# Altium schematic sheet Sheet1.SchDoc
size A4
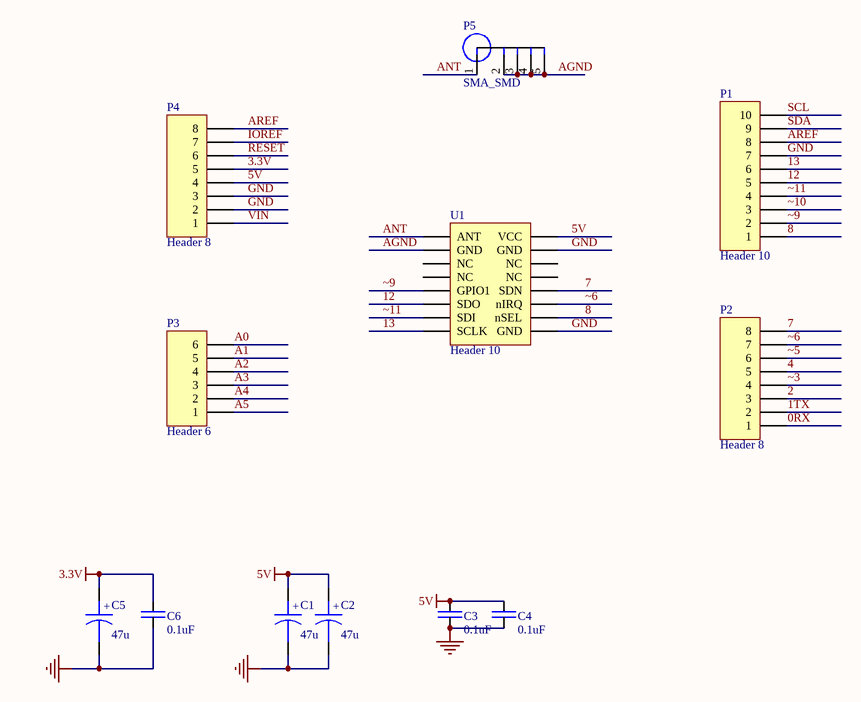
[diagram p0: Sheet1.SchDoc]

## Parts
C1  47u  [3216C]
C2  47u  [3216C]
C3  0.1uF  [0603]
C4  0.1uF  [0603]
C5  47u  [3216C]
C6  0.1uF  [0603]
P1  Header 10  [HDR1X10]
P2  Header 8  [HDR1X8]
P3  Header 6  [HDR1X6]
P4  Header 8  [HDR1X8]
P5  SMA_SMD  [SMA]
U1  Header 10  [RF4463F30]

## Nets
3.3V: C5.1 C6.1 P4.5
5V: C1.1 C2.1 C3.1 C4.1 P4.4 U1.1(VCC)
GND: C1.2 C2.2 C3.2 C4.2 C5.2 C6.2 P1.7 P4.2 P4.3 U1.2(GND) U1.8(GND)
0RX: P2.1
1TX: P2.2
2: P2.3
4: P2.5
7: P2.8 U1.5(SDN)
8: P1.1 U1.7(nSEL)
12: P1.5 U1.11(SDO)
13: P1.6 U1.9(SCLK)
A0: P3.6
A1: P3.5
A2: P3.4
A3: P3.3
A4: P3.2
A5: P3.1
AGND: P5.2 P5.3 P5.4 P5.5 U1.15(GND)
ANT: P5.1 U1.16(ANT)
AREF: P1.8 P4.8
IOREF: P4.7
RESET: P4.6
SCL: P1.10
SDA: P1.9
VIN: P4.1
~3: P2.4
~5: P2.6
~6: P2.7 U1.6(nIRQ)
~9: P1.2 U1.12(GPIO1)
~10: P1.3
~11: P1.4 U1.10(SDI)

Not connected (* = marked no-connect by the designer): U1 3(NC) 4(NC) 13(NC) 14(NC)

## Notes on the sheet
- (in symbol CAPACITOR POL) +

## Library data of the parts
C1 C2 C5 = CAPACITOR POL: Capacitor
C3 C4 C6 = CAP: Capacitor
P1 = Header 10: Header, 10-Pin; LatestRevisionDate: 17-Jul-2002; LatestRevisionNote: Re-released for DXP Platform.; Publisher: Altium Limited
P2 P4 = Header 8: Header, 8-Pin; LatestRevisionDate: 17-Jul-2002; LatestRevisionNote: Re-released for DXP Platform.; Publisher: Altium Limited
P3 = Header 6: Header, 6-Pin; LatestRevisionDate: 17-Jul-2002; LatestRevisionNote: Re-released for DXP Platform.; Publisher: Altium Limited
U1 = RF4463F30: Header, 10-Pin; LatestRevisionDate: 17-Jul-2002; LatestRevisionNote: Re-released for DXP Platform.; Publisher: Altium Limited